# EAGLE design AmbaSat-04-OPT3001 (EAGLE 9.5.1)
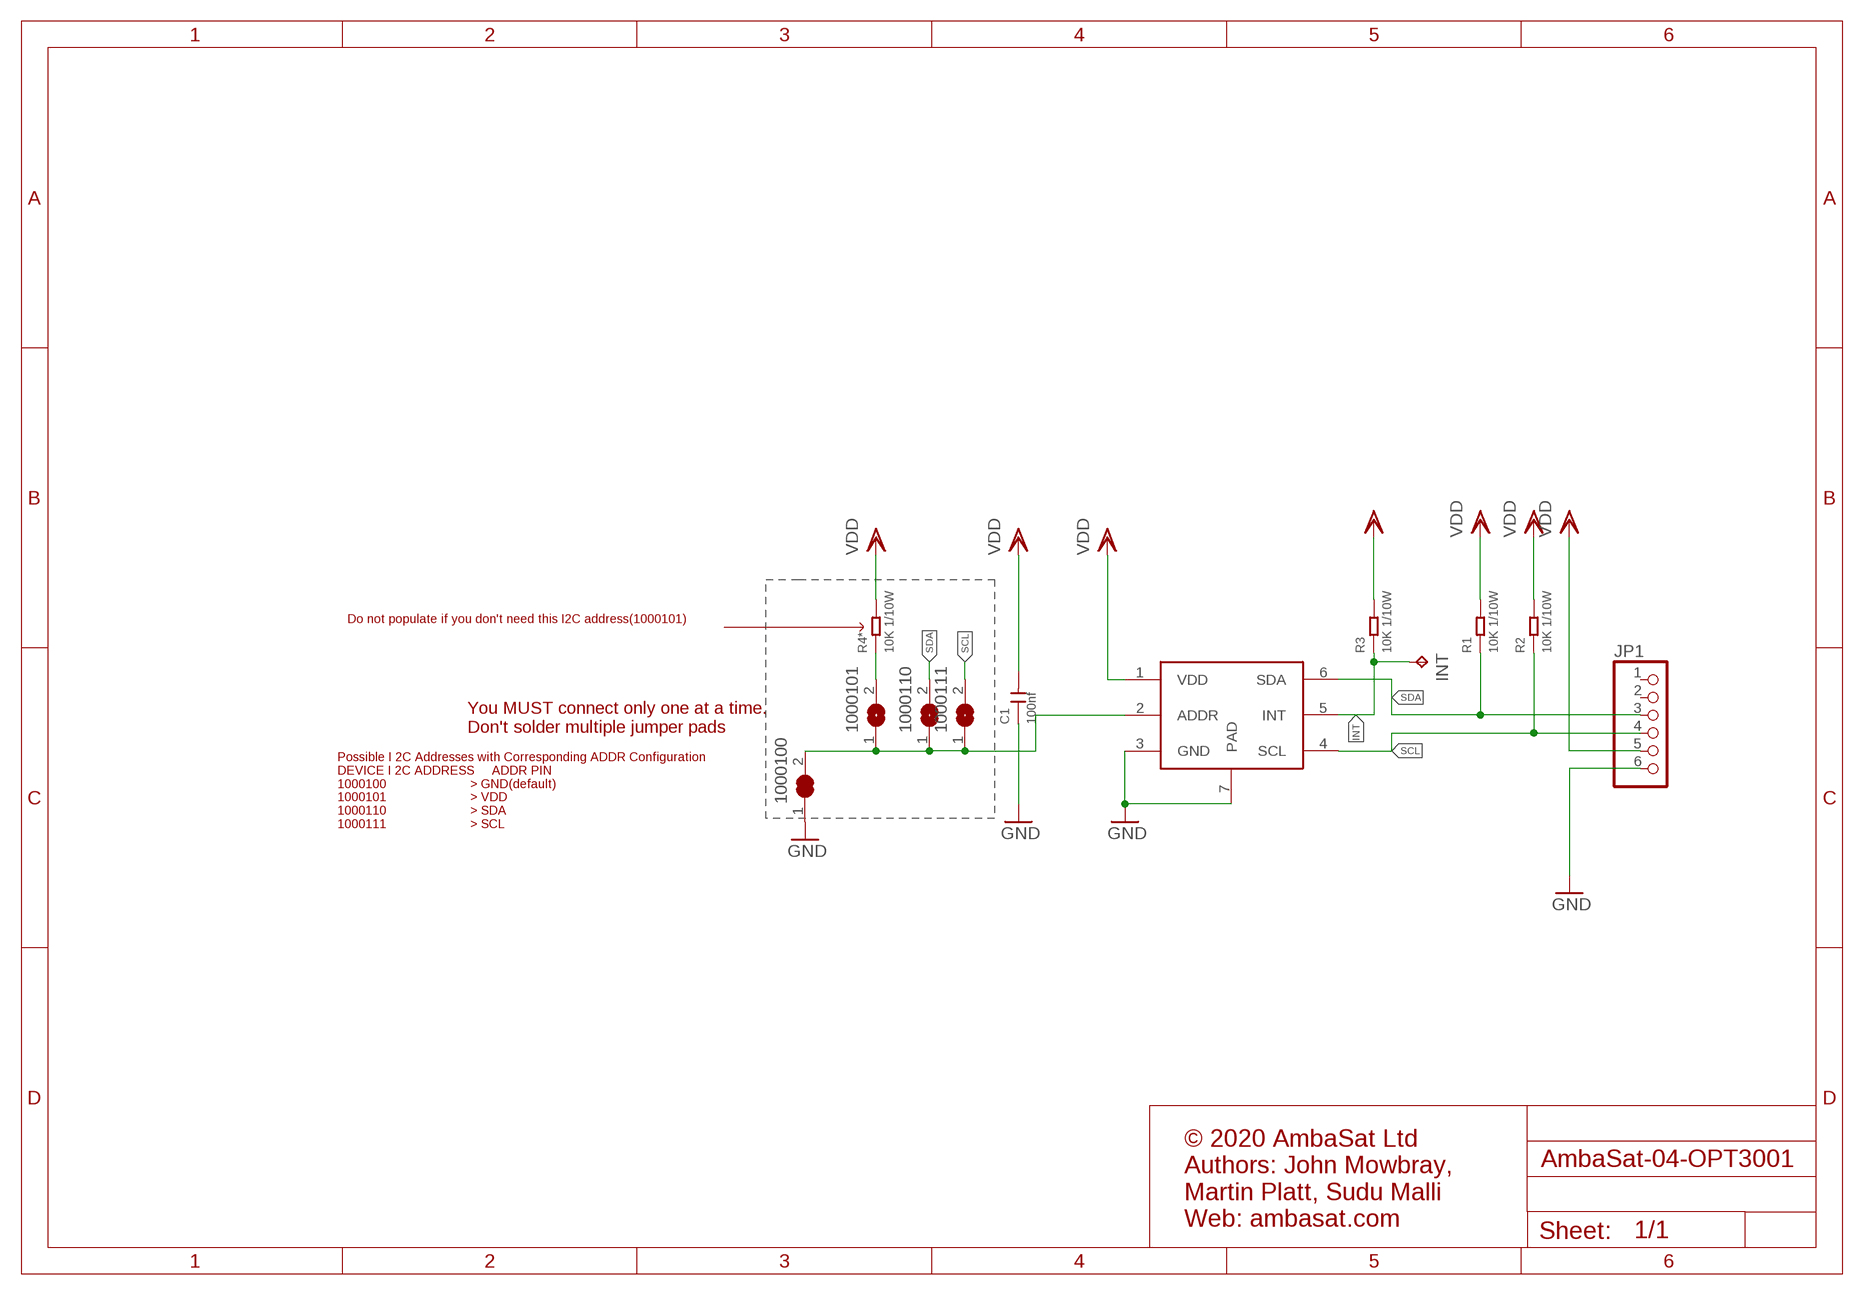
[diagram p0: schematic, sheet 1]

## Parts
1000100  SOLDERJUMPER_CLOSED  [SOLDERJUMPER_CLOSEDWIRE]
1000101  SJ  [SJ]
1000110  SJ  [SJ]
1000111  SJ  [SJ]
C1  100nf  CERAMIC-100NF-50V-10%-X7R(0603)  [C0603]
INT  TPTP11R  [TP11R]
JP1  HEADER-1X6  [1X06_OVAL]
R1  10K 1/10W  SMD-RES-10K-5%-1/10W(0603)  [R0603]
R2  10K 1/10W  SMD-RES-10K-5%-1/10W(0603)  [R0603]
R3  10K 1/10W  SMD-RES-10K-5%-1/10W(0603)  [R0603]
R4*  10K 1/10W  SMD-RES-10K-5%-1/10W(0603)  [R0603]
U2  OPT3001  [SON65P200X200X65-7N]

## Nets
GND: 1000100.1 C1.1 JP1.6 U2.3(GND) U2.7(PAD)
INT: INT.TP R3.1 U2.5(INT)
N$1: 1000101.2 R4*.1
N$3: 1000100.2 1000101.1 1000110.1 1000111.1 U2.2(ADDR)
SCL: 1000111.2 JP1.4 R2.1 U2.4(SCL)
SDA: 1000110.2 JP1.3 R1.1 U2.6(SDA)
VDD: C1.2 JP1.5 R1.2 R2.2 R3.2 R4*.2 U2.1(VDD)
Unconnected: JP1.1 JP1.2

## Notes on the sheet
- Do not populate if you don't need this I2C address(1000101)
- You MUST connect only one at a time.
  Don't solder multiple jumper pads
- Possible I 2C Addresses with Corresponding ADDR Configuration
  DEVICE I 2C ADDRESS     ADDR PIN
  1000100                        > GND(default)
  1000101                        > VDD
  1000110                        > SDA
  1000111                        > SCL
- © 2020 AmbaSat Ltd
  Authors: John Mowbray, 
  Martin Platt, Sudu Malli
  Web: ambasat.com

## Library data of the parts
1000100 = microbuilder:SOLDERJUMPER_CLOSED: Solder Jumper - Closed These solder jumpers are closed by default CLOSEDWIRE - 10 mil trace between pads that can be cut and resoldered later CLOSEDPERM - 63 mil trace between pads for a permanent connection (used to 'bridge' two signals, a shameless hack for Eagle). Can double as a test point as well (no cream layer)
1000101 1000110 1000111 = jumper:SJ: SMD solder JUMPER
C1 = Seeed-Capacitor:CERAMIC-100NF-50V-10%-X7R(0603): 302010138; MPN: CC0603KRX7R9BB104
INT = testpad:TP: Test pad
JP1 = microbuilder:HEADER-1X6: PIN HEADER
R1-R3 R4* = Seeed-Resistor:SMD-RES-10K-5%-1/10W(0603): 301010293; MPN: RC0603JR-0710KL
U2 = OPT3001:OPT3001: The OPT3001 is a sensor that measures the intensity of visible light. The spectral response of the sensor tightly matches the photopic response of the human eye and includes significant infrared rejection. The OPT3001 is a single-chip lux meter, measuring the intensity of light as visible by the human eye. The precision spectral response and strong IR rejection of the device enables the OPT3001 to accurately meter the intensity of light as seen by the human eye regardless of light source. The strong IR rejection also aids in maintaining high accuracy when industrial design calls for mounting the sensor under dark glass for aesthetics. The OPT3001 is designed for systems that create light-based experiences for humans, and an ideal preferred replacement for photodiodes, photoresistors, or other ambient light sensors with less human eye matching and IR rejection. Measurements can be made from 0.01 lux up to 83k lux without manually selecting full-scale ranges by using the built-in, full-scale setting feature. This capability allows light measurement over a 23-bit effective dynamic range. The digital operation is flexible for system integration. Measurements can be either continuous or singleshot. The control and interrupt system features autonomous operation, allowing the processor to sleep while the sensor searches for appropriate wake-up events to report via the interrupt pin. The digital output is reported over an I 2C- and SMBuscompatible, two-wire serial interface. The low power consumption and low power-supply voltage capability of the OPT3001 enhance the battery life of battery-powered systems.; M: Texas Instrument; MPN: OPT3001DNPT

## Board
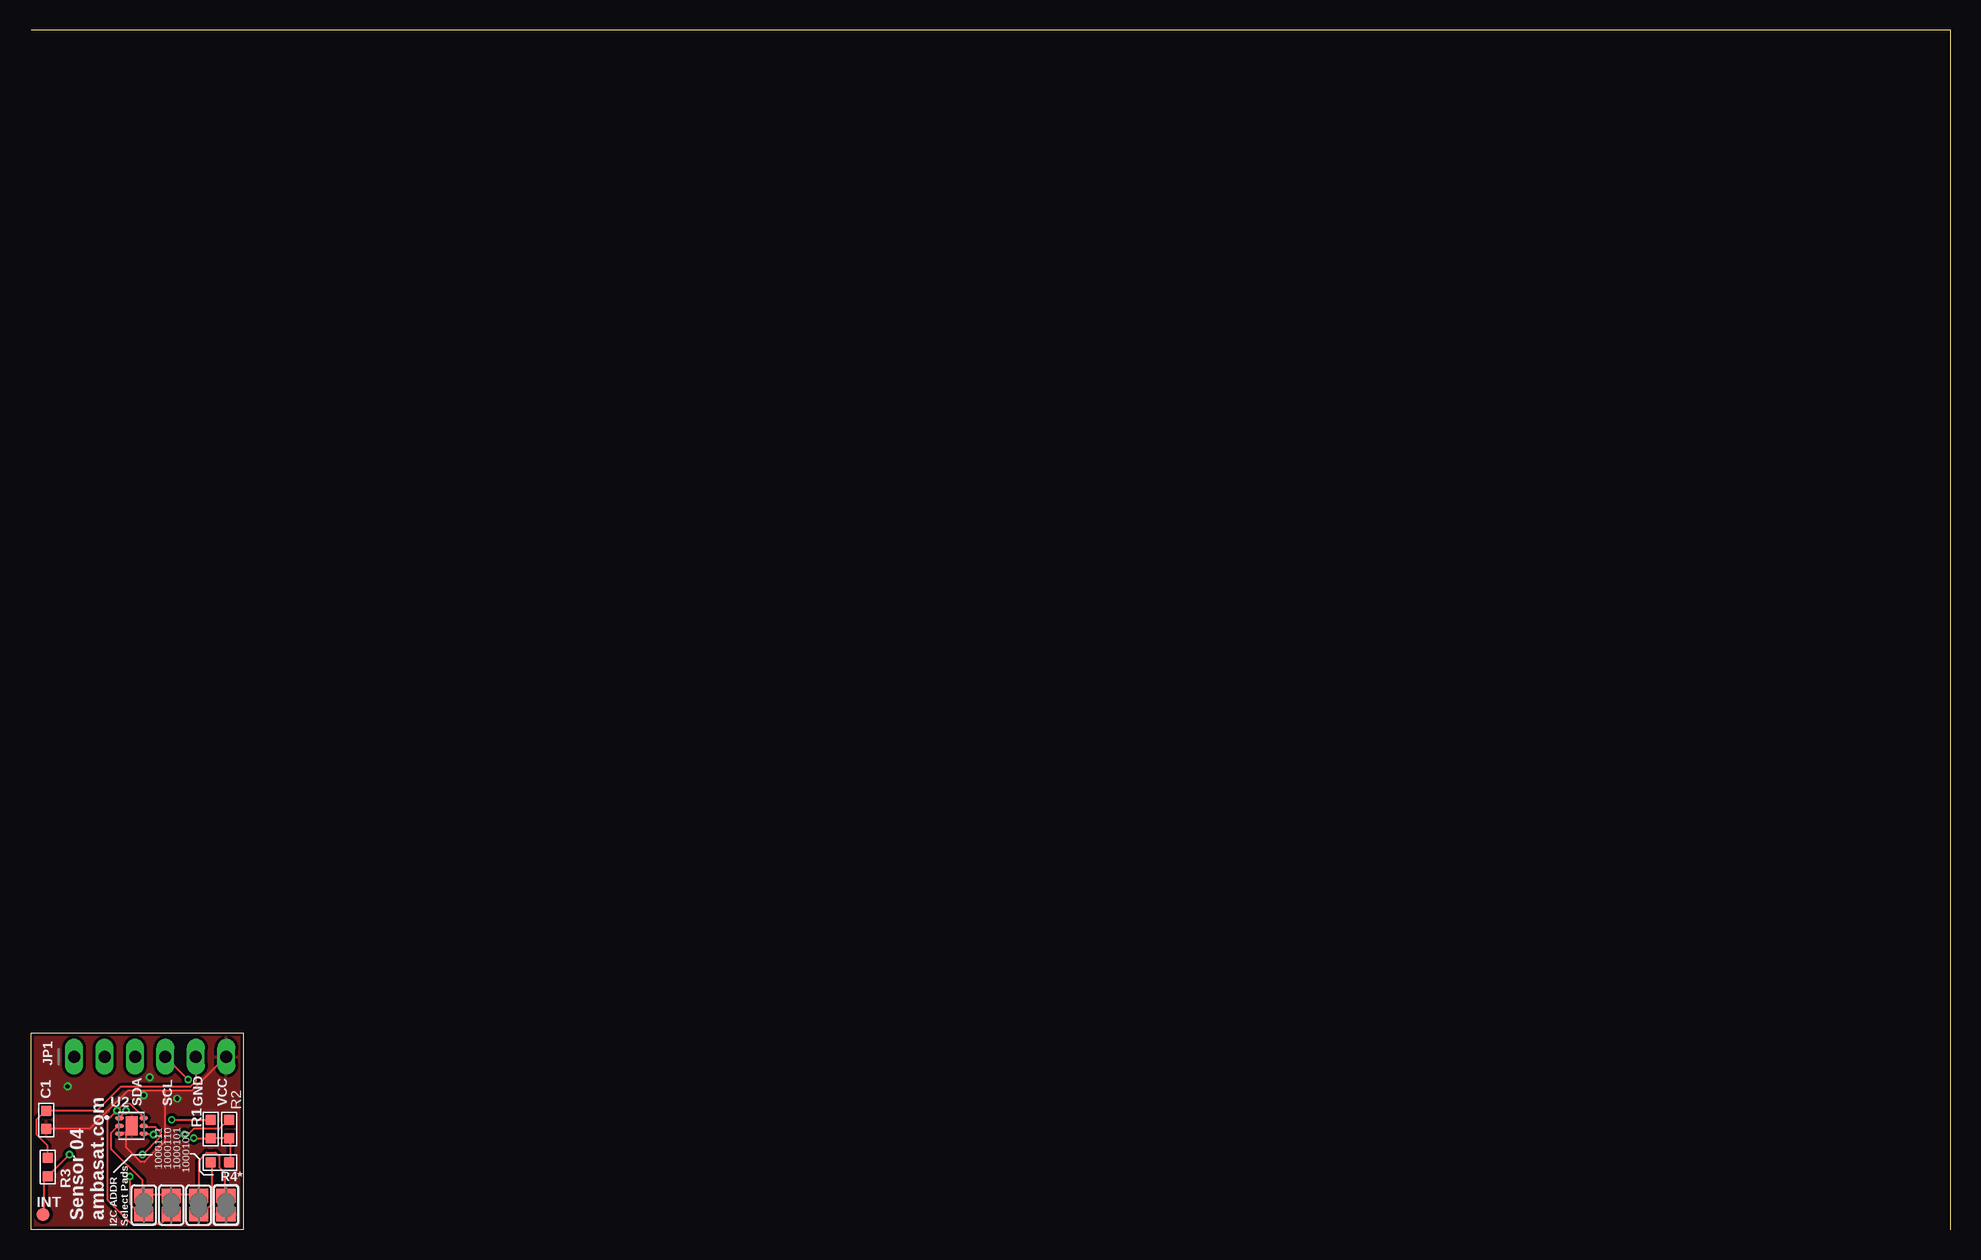
[diagram p1: board, top side]
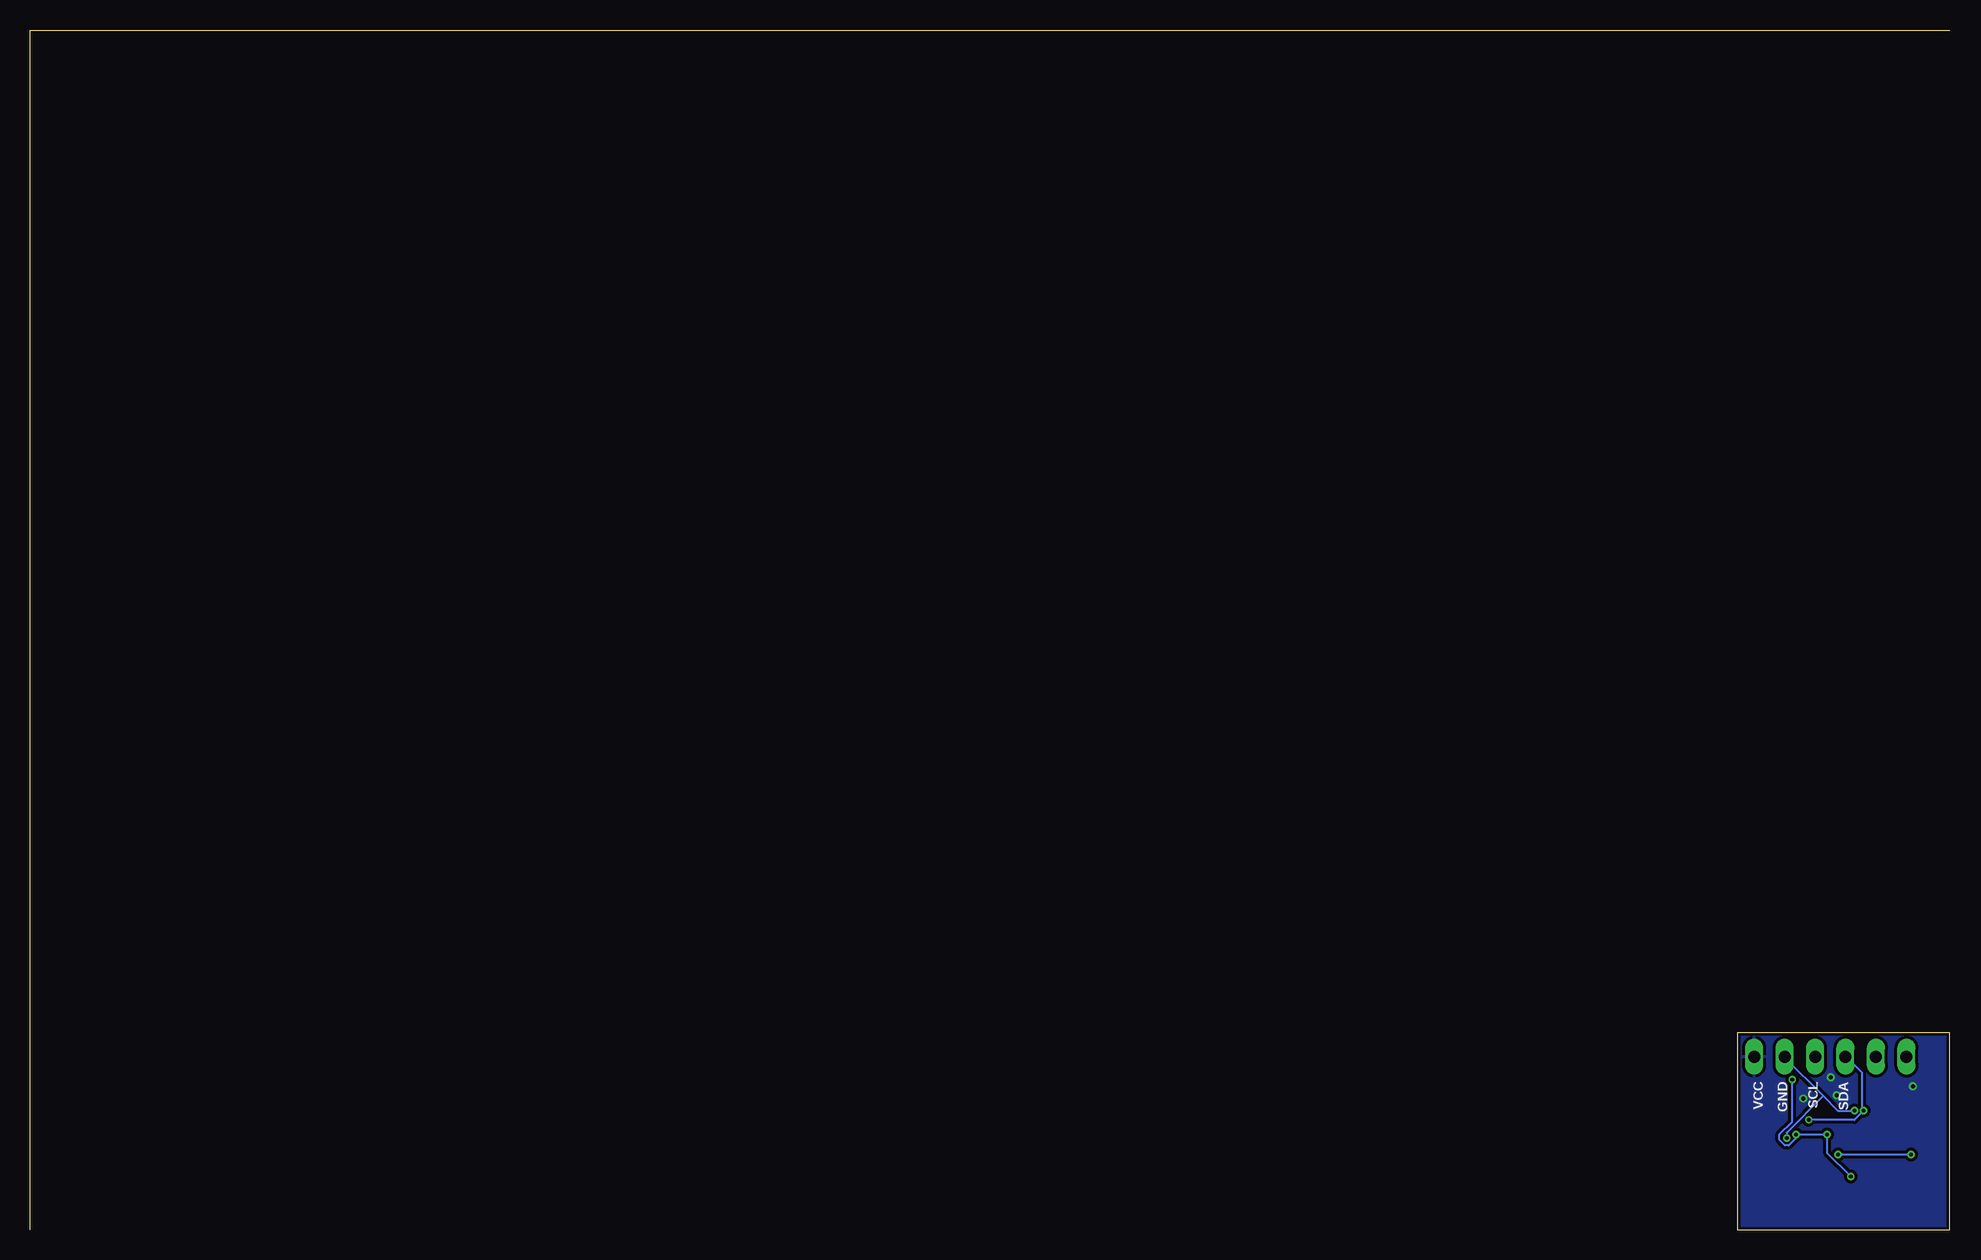
[diagram p2: board, bottom side, seen from below]

Size 160 x 100 mm. Coordinates in mm from the lower left corner, seen from the top.
Outline: 160,0 160,100 0,100
Outline: 0,16.4 17.7,16.4 17.7,0 0,0 0,16.4
Copper layers (1*16): Top 0.035mm / dielectric 1.5mm / Bottom 0.035mm
Design rules "SeeedStudio_2layer_DRU_no_angle_20140221": minimum track width 6mil, minimum drill 12mil, track to track 6mil, track to pad 6mil, pad to pad 6mil, via to via 6mil, smd to smd 0mil, copper to edge 10mil, drill to drill 10mil, minimum pad ring 10mil, minimum via ring 6mil, stop-mask expansion 2mil, vias tented up to drill 100mil, thermal gap 10mil

### Footprints (pad centres in the part's own frame; a part is rotated, then mirrored left to right if it is on the bottom)
SOLDERJUMPER_CLOSEDWIRE = smd 1.168 x 1.6: 1 -0.762,0; 2 0.762,0 | smd 0.635 x 0.203: WIRE 0,0
SJ = smd 1.168 x 1.6: 1 -0.762,0; 2 0.762,0
C0603 = smd 0.889 x 0.889: 1 0,0.762; 2 0,-0.762
TP11R = smd 1.1 x 1.1: TP 0,0
1X06_OVAL = drill 1 long: 1 -6.35,0; 2 -3.81,0; 3 -1.27,0; 4 1.27,0; 5 3.81,0; 6 6.35,0
R0603 = smd 0.889 x 0.889: 1 0,0.762; 2 0,-0.762
SON65P200X200X65-7N = smd 0.71 x 0.32: 1 -1.005,0.65; 2 -1.005,0; 3 -1.005,-0.65; 4 1.005,-0.65; 5 1.005,0; 6 1.005,0.65 | smd 1 x 1.6: 7 0,0

### Placement (x,y rotation side)
1000100  16.26,2.03 90 top
1000101  13.97,2.03 270 top
1000110  11.68,2.03 270 top
1000111  9.4,2.03 270 top
C1  1.27,9.14 180 top
INT  1.02,1.27 0 top
JP1  9.94,14.4 0 top
R1  14.99,8.38 0 top
R2  16.51,8.38 0 top
R3  1.4,5.21 180 top
R4*  15.75,5.59 90 top
U2  8.38,8.64 0 top

### Tracks (layer width: path | path; a pad name or v marks a point on that pad's centre or on a via)
GND  (via drill 0.35)
  Top 0.152: 7.92,8.08 7.47,8.08 U2.3 | 7.92,8.08 8.38,8.53 U2.7 7.92,8.08 | C1.1 4.88,8.38 8.08,11.58 11.12,11.58 | 11.12,11.58 13.41,11.58 16.15,14.33 JP1.6 | 7.92,8.08 7.92,6.86 9.14,5.64 9.45,5.64 11.12,7.32 11.12,11.58
  other vias: 3.05,11.94 9.4,11.18 12.19,10.92 9.91,12.7
  pour Top (isolate 0.254): 0,16.4 0,0 17.7,0 17.7,16.4
  pour Bottom (isolate 0.254): 0,16.4 0,0 17.7,0 17.7,16.4
INT  (via drill 0.3)
  Top 0.152: v9.3,6.25 10.82,7.77 10.82,8.08 10.36,8.53 9.45,8.53 U2.5 | v3.2,6.25 R3.1 1.07,4.12 1.07,1.37 INT.TP
  Bottom 0.152: v3.2,6.25 v9.3,6.25
N$1
  Top 0.152: R4*.1 15.09,5.49 15.09,2.13 14.33,1.37 14.02,1.37 1000101.2
N$3
  Top 0.152: U2.2 7.32,8.53 7.16,8.53 6.71,8.08 6.71,6.71 9.3,4.12 9.3,2.9 1000111.1 9.45,2.9 11.58,2.9 1000110.1 11.73,2.9 13.87,2.9 1000101.1 14.02,2.9 14.02,5.79 14.63,6.4 15.39,6.4 15.7,6.1 15.7,5.18 16.15,4.72 16.15,2.9 1000100.2
SCL  (via drill 0.3)
  Top 0.152: v10.21,7.92 9.45,7.92 U2.4 | v12.8,7.92 13.11,7.92 13.56,8.38 15.7,8.38 16.46,9.14 R2.1 | v8.23,4.42 8.23,2.13 8.99,1.37 9.3,1.37 1000111.2 | v13.11,12.5 11.28,14.33 JP1.4
  Bottom 0.152: v12.8,7.92 12.5,7.92 | 12.5,7.92 v10.21,7.92 10.21,6.4 v8.23,4.42 | v13.11,12.5 13.11,8.99 14.17,7.92 14.17,7.47 13.72,7.01 13.41,7.01 12.5,7.92
SDA  (via drill 0.3)
  Top 0.152: U2.6 9.3,9.3 9.3,9.45 8.23,10.52 7.77,10.52 v7.16,9.91 6.4,9.14 6.4,2.44 8.38,0.46 10.82,0.46 11.58,1.22 1000110.2 | v11.73,9.14 R1.1
  Bottom 0.152: v11.73,9.14 7.92,9.14 7.32,9.75 7.32,9.91 | 7.32,9.91 7.32,13.11 8.53,14.33 JP1.3 | 7.32,9.91 v7.16,9.91
VDD  (via drill 0.3)
  Top 0.152: R3.2 1.37,6.1 1.37,7.01 0.46,7.92 0.46,9.14 1.22,9.91 C1.2 5.49,9.91 7.47,11.89 13.26,11.89 13.72,12.34 13.72,14.33 JP1.5 | R4*.2 16.61,5.64 16.61,7.62 R2.2 R1.2 v13.56,7.62 | v7.92,9.91 7.47,9.45 7.47,9.3 U2.1
  Bottom 0.152: v7.92,9.91 9.3,9.91 10.52,11.12 | 10.52,11.12 13.72,14.33 JP1.5 | v13.56,7.62 13.56,8.08 10.52,11.12

### Text on the board
tPlace: SDA | SCL | GND | VCC | Sensor 04 / ambasat.com | I2C ADDR / Select Pads
bPlace: SDA | SCL | GND | VCC